# EAGLE board dachshund104 (EAGLE 9.7.0), part 1 of 3
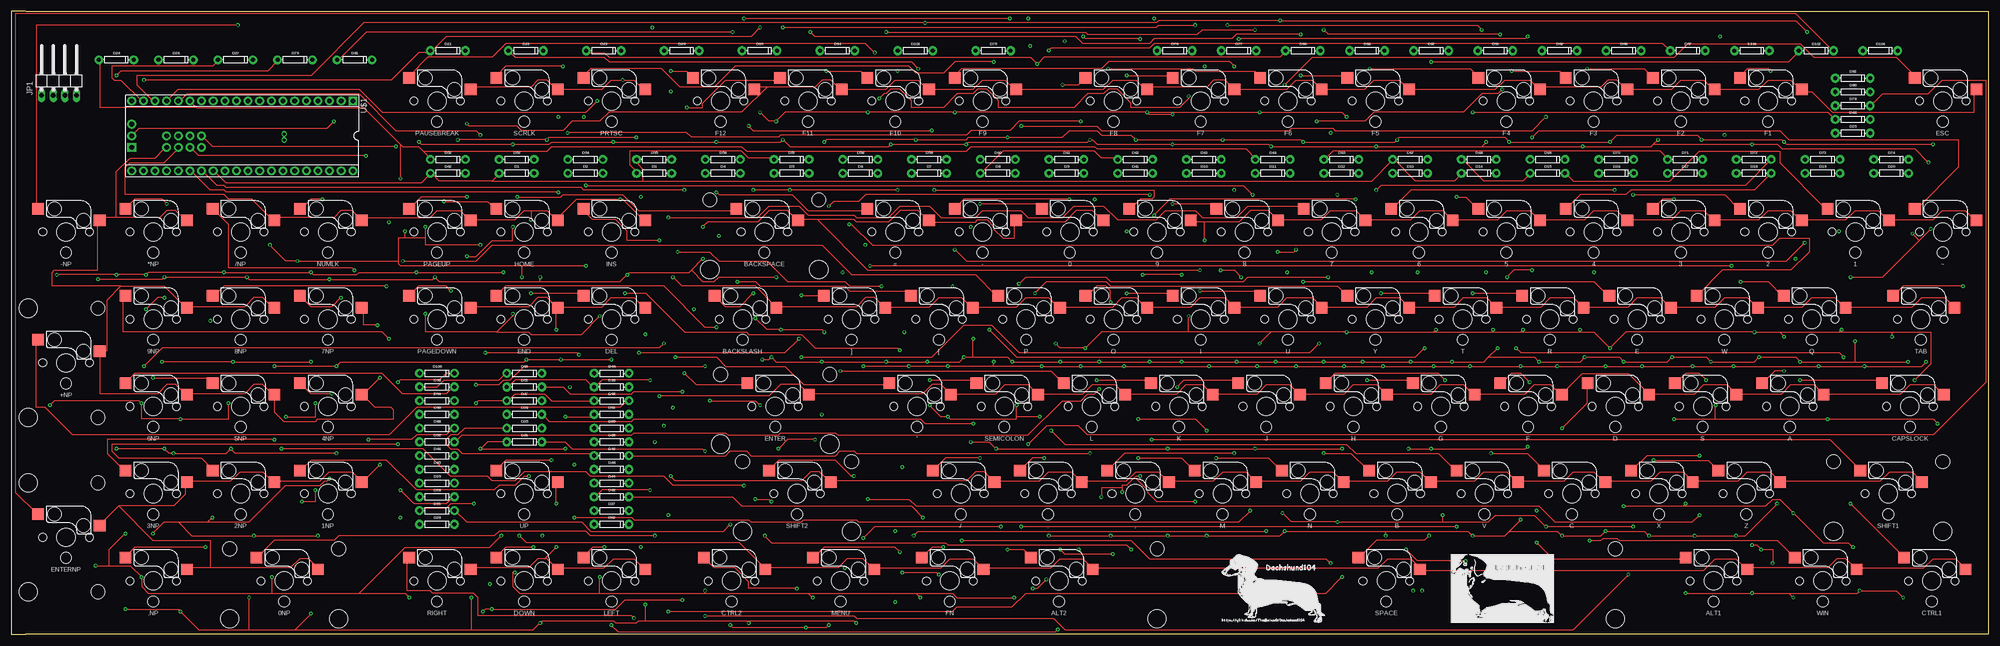
[diagram p5: board, top side]
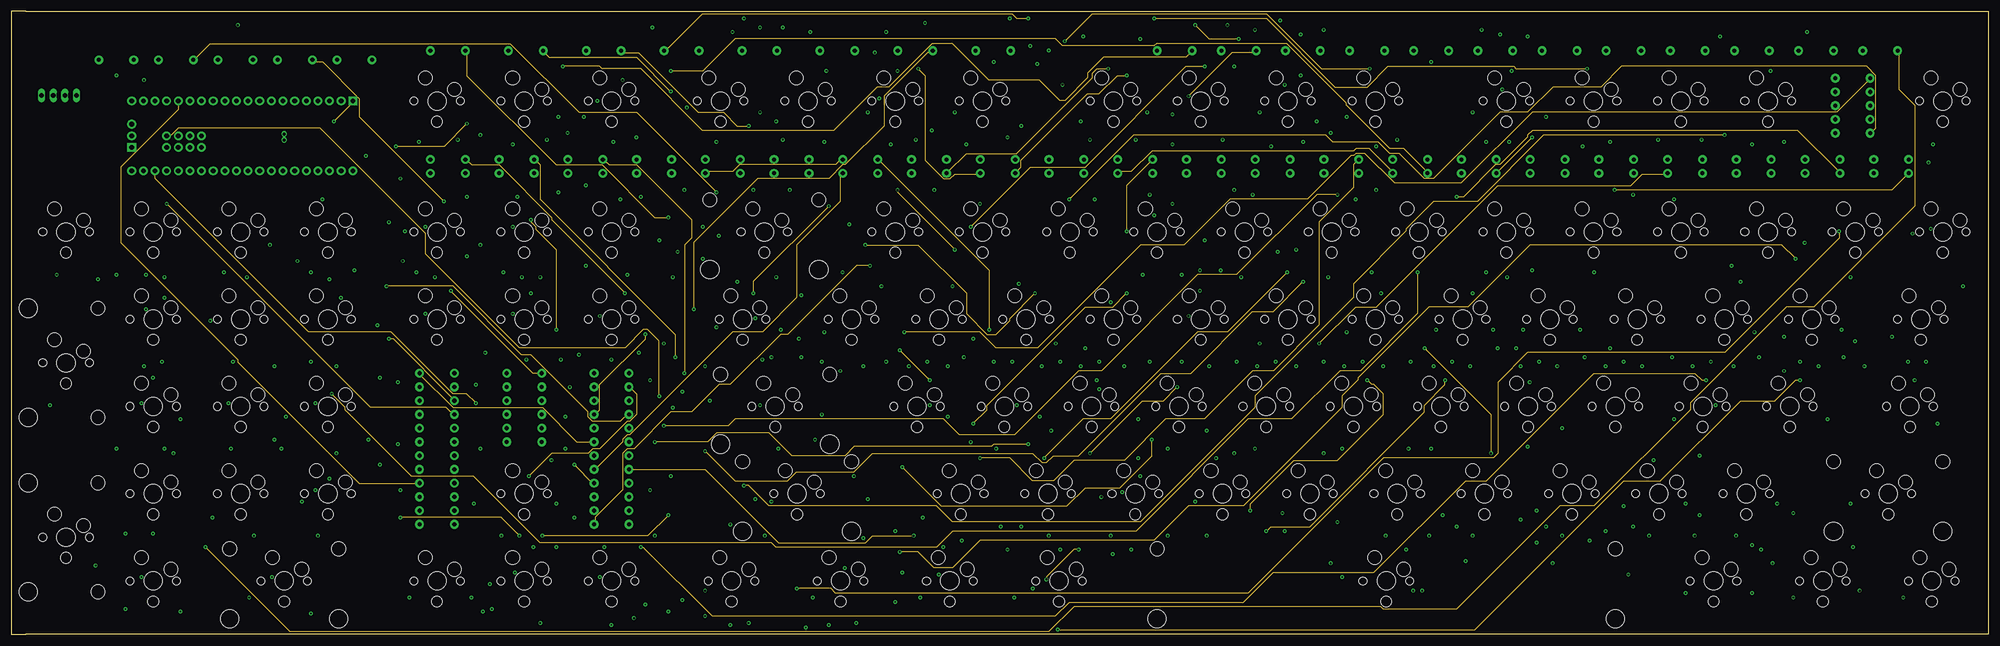
[diagram p6: board, inner layer Route2]
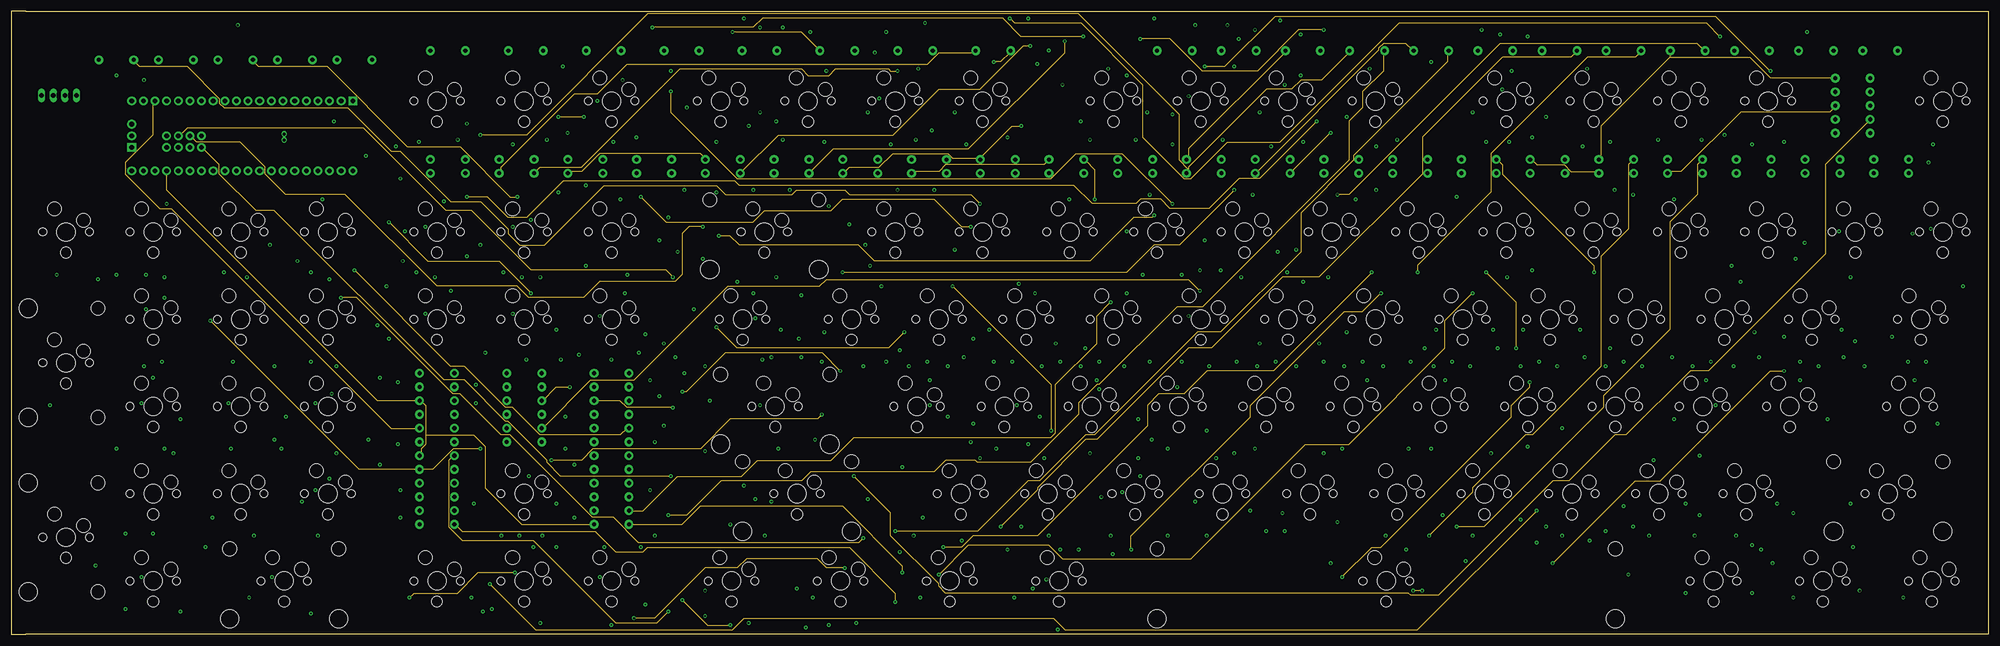
[diagram p7: board, inner layer Route15]
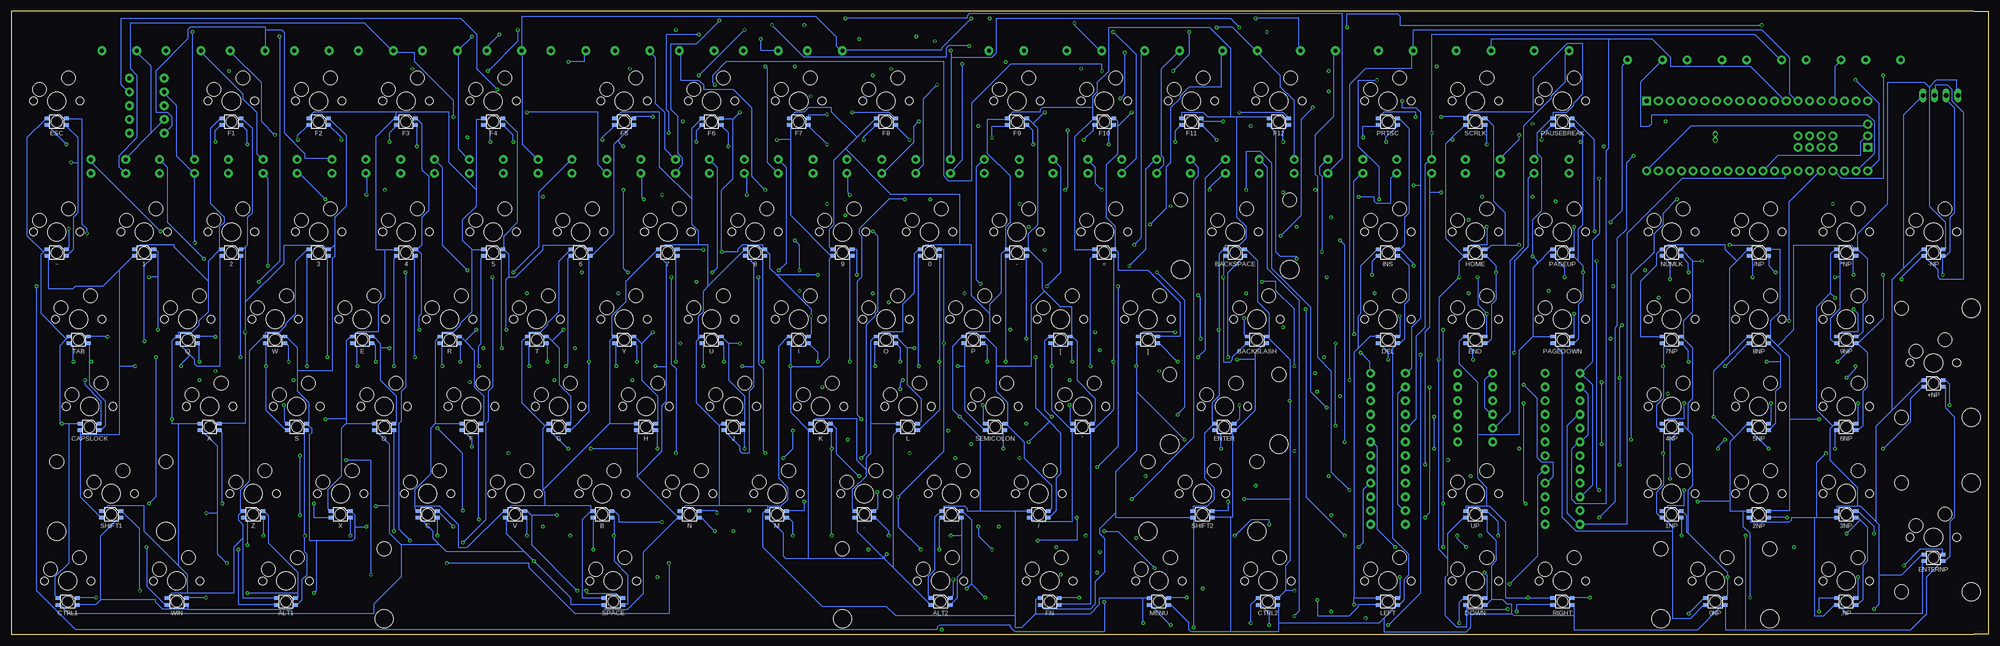
[diagram p8: board, bottom side, seen from below]

Size 431.38 x 136 mm. Coordinates in mm from the lower left corner, seen from the top.
Outline: 431.38,127 431.38,63.75 431.38,0 348.38,0 3.13,0 0.38,0 0,0 0,136 1.19,136 3.13,136 12.88,136 431.38,136 431.38,130.9 431.38,127
Copper layers (1+2*15+16): Top 0.035mm / dielectric 1.5mm / Route2 0.035mm / dielectric 0.15mm / Route15 0.035mm / dielectric 0.2mm / Bottom 0.035mm
Design rules "default *": minimum track width 0.2mm, minimum drill 0.35mm, track to track 0.5mm, track to pad 0.3mm, pad to pad 0.3mm, via to via 3mm, smd to smd 6mil, copper to edge 0.3mm, drill to drill 0.4mm, minimum pad ring 10mil, minimum via ring 8mil, stop-mask expansion 4mil, vias tented up to drill 0mil, thermal gap 10mil

## Footprints (pad centres in the part's own frame; a part is rotated, then mirrored left to right if it is on the bottom)
MXHSPCB-1U-SMDRGB = smd 1 x 0.75 bottom: B- 2.1,-5.225; G- -2.1,-5.225; LED+ 2.1,-3.775; R- -2.1,-3.775 | smd 2.55 x 2.5: MX1 7.36,2.54; MX2 -6.09,5.08 | hole 4: 0,0 | hole 1.7: 5.08,0; -5.08,0 | hole 3: 3.81,2.54; -2.54,5.08 | hole 2.4: 0,-4.5
MXHSPCB-2U-SMDRGB = smd 1 x 0.75 bottom: B- 2.1,-5.225; G- -2.1,-5.225; LED+ 2.1,-3.775; R- -2.1,-3.775 | smd 2.55 x 2.5: MX1 7.36,2.54; MX2 -6.09,5.08 | hole 4: 0,0; -11.9,-8.24; 11.9,-8.24 | hole 1.7: 5.08,0; -5.08,0 | hole 3: 3.81,2.54; -2.54,5.08 | hole 2.4: 0,-4.5 | hole 3.05: -11.9,7; 11.9,7
MXHSPCB-2U-SMDRGB-ROTATED = smd 1 x 0.75 bottom: B- 2.1,-5.225; G- -2.1,-5.225; LED+ 2.1,-3.775; R- -2.1,-3.775 | smd 2.55 x 2.5: MX1 7.36,2.54; MX2 -6.09,5.08 | hole 4: 0,0; -8.24,-11.9; -8.24,11.9 | hole 1.7: 5.08,0; -5.08,0 | hole 3: 3.81,2.54; -2.54,5.08 | hole 2.4: 0,-4.5 | hole 3.05: 7,-11.9; 7,11.9
DIODE-1N4148 = drill 0.9 pad 1.88: A -3.81,0; C 3.81,0
1X04/90 = drill 1.016 long: 1 -3.81,-3.81; 2 -1.27,-3.81; 3 1.27,-3.81; 4 3.81,-3.81
MXHSPCB-6.25U-SMDRGB = smd 1 x 0.75 bottom: B- 2.1,-5.225; G- -2.1,-5.225; LED+ 2.1,-3.775; R- -2.1,-3.775 | smd 2.55 x 2.5: MX1 7.36,2.54; MX2 -6.09,5.08 | hole 4: 0,0; -50,-8.24; 50,-8.24 | hole 1.7: 5.08,0; -5.08,0 | hole 3: 3.81,2.54; -2.54,5.08 | hole 2.4: 0,-4.5 | hole 3.05: -50,7; 50,7
TEENSY++ = drill 1.016 pad 1.88: 5V 24.13,-2.54; +5V -24.13,7.62; A0 8.89,0; A1 11.43,0; A2 13.97,0; A3 16.51,0; A4 8.89,2.54; A5 11.43,2.54; A6 13.97,2.54; A7 16.51,2.54; B0 -6.35,7.62; B1 -8.89,7.62; B2 -11.43,7.62; B3 -13.97,7.62; B4 -16.51,7.62; B5 -19.05,7.62; B6 -21.59,7.62; B7 -21.59,-7.62; C0 6.35,-7.62; C1 8.89,-7.62; C2 11.43,-7.62; C3 13.97,-7.62; C4 16.51,-7.62; C5 19.05,-7.62; C6 21.59,-7.62; C7 24.13,-7.62; D0 -19.05,-7.62; D1 -16.51,-7.62; D2 -13.97,-7.62; D3 -11.43,-7.62; D4 -8.89,-7.62; D5 -6.35,-7.62; D6 -3.81,-7.62; D7 -1.27,-7.62; E0 1.27,-7.62; E1 3.81,-7.62; E6 -1.27,7.62; E7 -3.81,7.62; F0 6.35,7.62; F1 8.89,7.62; F2 11.43,7.62; F3 13.97,7.62; F4 16.51,7.62; F5 19.05,7.62; F6 21.59,7.62; F7 24.13,7.62; GND2 24.13,0; GRND1 1.27,7.62; REF 3.81,7.62 | drill 0.635 pad 1.067: E4 -9.144,0.914; E5 -9.144,-0.406 | drill 1.016 pad 1.88 square: GND -24.13,-7.62; RST 24.13,2.54

## Placement (x,y rotation side)
0  KEYSWITCH-RGBSMDLED-MXHSPCB-1U-SMDRGB  [MXHSPCB-1U-SMDRGB]  230.98,87.85 0 top
0NP  KEYSWITCH-RGBSMDLED-MXHSPCB-2U-SMDRGB  [MXHSPCB-2U-SMDRGB]  59.53,11.65 0 top
1  KEYSWITCH-RGBSMDLED-MXHSPCB-1U-SMDRGB  [MXHSPCB-1U-SMDRGB]  402.43,87.85 0 top
1NP  KEYSWITCH-RGBSMDLED-MXHSPCB-1U-SMDRGB  [MXHSPCB-1U-SMDRGB]  69.06,30.7 0 top
2  KEYSWITCH-RGBSMDLED-MXHSPCB-1U-SMDRGB  [MXHSPCB-1U-SMDRGB]  383.38,87.85 0 top
2NP  KEYSWITCH-RGBSMDLED-MXHSPCB-1U-SMDRGB  [MXHSPCB-1U-SMDRGB]  50.01,30.7 0 top
3  KEYSWITCH-RGBSMDLED-MXHSPCB-1U-SMDRGB  [MXHSPCB-1U-SMDRGB]  364.33,87.85 0 top
3NP  KEYSWITCH-RGBSMDLED-MXHSPCB-1U-SMDRGB  [MXHSPCB-1U-SMDRGB]  30.96,30.7 0 top
4  KEYSWITCH-RGBSMDLED-MXHSPCB-1U-SMDRGB  [MXHSPCB-1U-SMDRGB]  345.28,87.85 0 top
4NP  KEYSWITCH-RGBSMDLED-MXHSPCB-1U-SMDRGB  [MXHSPCB-1U-SMDRGB]  69.06,49.75 0 top
5  KEYSWITCH-RGBSMDLED-MXHSPCB-1U-SMDRGB  [MXHSPCB-1U-SMDRGB]  326.23,87.85 0 top
5NP  KEYSWITCH-RGBSMDLED-MXHSPCB-1U-SMDRGB  [MXHSPCB-1U-SMDRGB]  50.01,49.75 0 top
6  KEYSWITCH-RGBSMDLED-MXHSPCB-1U-SMDRGB  [MXHSPCB-1U-SMDRGB]  307.18,87.85 0 top
6NP  KEYSWITCH-RGBSMDLED-MXHSPCB-1U-SMDRGB  [MXHSPCB-1U-SMDRGB]  30.96,49.75 0 top
7  KEYSWITCH-RGBSMDLED-MXHSPCB-1U-SMDRGB  [MXHSPCB-1U-SMDRGB]  288.13,87.85 0 top
7NP  KEYSWITCH-RGBSMDLED-MXHSPCB-1U-SMDRGB  [MXHSPCB-1U-SMDRGB]  69.06,68.8 0 top
8  KEYSWITCH-RGBSMDLED-MXHSPCB-1U-SMDRGB  [MXHSPCB-1U-SMDRGB]  269.08,87.85 0 top
8NP  KEYSWITCH-RGBSMDLED-MXHSPCB-1U-SMDRGB  [MXHSPCB-1U-SMDRGB]  50.01,68.8 0 top
9  KEYSWITCH-RGBSMDLED-MXHSPCB-1U-SMDRGB  [MXHSPCB-1U-SMDRGB]  250.03,87.85 0 top
9NP  KEYSWITCH-RGBSMDLED-MXHSPCB-1U-SMDRGB  [MXHSPCB-1U-SMDRGB]  30.96,68.8 0 top
'  KEYSWITCH-RGBSMDLED-MXHSPCB-1U-SMDRGB  [MXHSPCB-1U-SMDRGB]  197.64,49.75 0 top
*NP  KEYSWITCH-RGBSMDLED-MXHSPCB-1U-SMDRGB  [MXHSPCB-1U-SMDRGB]  30.96,87.85 0 top
+NP  KEYSWITCH-RGBSMDLED-MXHSPCB-2U-SMDRGB-ROTATED  [MXHSPCB-2U-SMDRGB-ROTATED]  11.91,59.28 0 top
,  KEYSWITCH-RGBSMDLED-MXHSPCB-1U-SMDRGB  [MXHSPCB-1U-SMDRGB]  245.27,30.7 0 top
,NP  KEYSWITCH-RGBSMDLED-MXHSPCB-1U-SMDRGB  [MXHSPCB-1U-SMDRGB]  30.96,11.65 0 top
-  KEYSWITCH-RGBSMDLED-MXHSPCB-1U-SMDRGB  [MXHSPCB-1U-SMDRGB]  211.93,87.85 0 top
-NP  KEYSWITCH-RGBSMDLED-MXHSPCB-1U-SMDRGB  [MXHSPCB-1U-SMDRGB]  11.91,87.85 0 top
.  KEYSWITCH-RGBSMDLED-MXHSPCB-1U-SMDRGB  [MXHSPCB-1U-SMDRGB]  226.22,30.7 0 top
/  KEYSWITCH-RGBSMDLED-MXHSPCB-1U-SMDRGB  [MXHSPCB-1U-SMDRGB]  207.17,30.7 0 top
/NP  KEYSWITCH-RGBSMDLED-MXHSPCB-1U-SMDRGB  [MXHSPCB-1U-SMDRGB]  50.01,87.85 0 top
=  KEYSWITCH-RGBSMDLED-MXHSPCB-1U-SMDRGB  [MXHSPCB-1U-SMDRGB]  192.88,87.85 0 top
[  KEYSWITCH-RGBSMDLED-MXHSPCB-1U-SMDRGB  [MXHSPCB-1U-SMDRGB]  202.41,68.8 0 top
]  KEYSWITCH-RGBSMDLED-MXHSPCB-1U-SMDRGB  [MXHSPCB-1U-SMDRGB]  183.36,68.8 0 top
A  KEYSWITCH-RGBSMDLED-MXHSPCB-1U-SMDRGB  [MXHSPCB-1U-SMDRGB]  388.14,49.75 0 top
ALT1  KEYSWITCH-RGBSMDLED-MXHSPCB-1U-SMDRGB  [MXHSPCB-1U-SMDRGB]  371.48,11.65 0 top
ALT2  KEYSWITCH-RGBSMDLED-MXHSPCB-1U-SMDRGB  [MXHSPCB-1U-SMDRGB]  228.6,11.65 0 top
B  KEYSWITCH-RGBSMDLED-MXHSPCB-1U-SMDRGB  [MXHSPCB-1U-SMDRGB]  302.42,30.7 0 top
BACKSLASH  KEYSWITCH-RGBSMDLED-MXHSPCB-1U-SMDRGB  [MXHSPCB-1U-SMDRGB]  159.54,68.8 0 top
BACKSPACE  KEYSWITCH-RGBSMDLED-MXHSPCB-2U-SMDRGB  [MXHSPCB-2U-SMDRGB]  164.31,87.85 0 top
C  KEYSWITCH-RGBSMDLED-MXHSPCB-1U-SMDRGB  [MXHSPCB-1U-SMDRGB]  340.52,30.7 0 top
CAPSLOCK  KEYSWITCH-RGBSMDLED-MXHSPCB-1U-SMDRGB  [MXHSPCB-1U-SMDRGB]  414.34,49.75 0 top
CTRL1  KEYSWITCH-RGBSMDLED-MXHSPCB-1U-SMDRGB  [MXHSPCB-1U-SMDRGB]  419.1,11.65 0 top
CTRL2  KEYSWITCH-RGBSMDLED-MXHSPCB-1U-SMDRGB  [MXHSPCB-1U-SMDRGB]  157.16,11.65 0 top
D  KEYSWITCH-RGBSMDLED-MXHSPCB-1U-SMDRGB  [MXHSPCB-1U-SMDRGB]  350.04,49.75 0 top
D1  200mA/100V/1V  [DIODE-1N4148]  110.25,100.66 0 top
D2  200mA/100V/1V  [DIODE-1N4148]  125.25,100.66 0 top
D3  200mA/100V/1V  [DIODE-1N4148]  140.25,100.66 0 top
D4  200mA/100V/1V  [DIODE-1N4148]  155.25,100.66 0 top
D5  200mA/100V/1V  [DIODE-1N4148]  170.25,100.66 0 top
D6  200mA/100V/1V  [DIODE-1N4148]  185.25,100.66 0 top
D7  200mA/100V/1V  [DIODE-1N4148]  200.25,100.66 0 top
D8  200mA/100V/1V  [DIODE-1N4148]  215.25,100.66 0 top
D9  200mA/100V/1V  [DIODE-1N4148]  230.25,100.66 0 top
D10  200mA/100V/1V  [DIODE-1N4148]  260.25,100.66 0 top
D11  200mA/100V/1V  [DIODE-1N4148]  275.25,100.66 0 top
D12  200mA/100V/1V  [DIODE-1N4148]  290.25,100.66 0 top
D13  200mA/100V/1V  [DIODE-1N4148]  305.25,100.66 0 top
D14  200mA/100V/1V  [DIODE-1N4148]  320.25,100.66 0 top
D15  200mA/100V/1V  [DIODE-1N4148]  335.25,100.66 0 top
D16  200mA/100V/1V  [DIODE-1N4148]  350.25,100.66 0 top
D17  200mA/100V/1V  [DIODE-1N4148]  365.25,100.66 0 top
D18  200mA/100V/1V  [DIODE-1N4148]  380.25,100.66 0 top
D19  200mA/100V/1V  [DIODE-1N4148]  395.25,100.66 0 top
D20  200mA/100V/1V  [DIODE-1N4148]  410.25,100.66 0 top
D21  200mA/100V/1V  [DIODE-1N4148]  95.25,127.42 0 top
D22  200mA/100V/1V  [DIODE-1N4148]  112.25,127.42 0 top
D23  200mA/100V/1V  [DIODE-1N4148]  129.25,127.42 0 top
D24  200mA/100V/1V  [DIODE-1N4148]  22.88,125.42 0 top
D25  200mA/100V/1V  [DIODE-1N4148]  401.86,109.42 0 top
D26  200mA/100V/1V  [DIODE-1N4148]  35.88,125.42 0 top
D27  200mA/100V/1V  [DIODE-1N4148]  48.88,125.42 0 top
D28  200mA/100V/1V  [DIODE-1N4148]  92.87,24 0 top
D29  200mA/100V/1V  [DIODE-1N4148]  146.25,127.42 0 top
D30  200mA/100V/1V  [DIODE-1N4148]  163.25,127.42 0 top
D31  200mA/100V/1V  [DIODE-1N4148]  111.92,42 0 top
D32  200mA/100V/1V  [DIODE-1N4148]  130.97,24 0 top
D33  200mA/100V/1V  [DIODE-1N4148]  92.87,27 0 top
D34  200mA/100V/1V  [DIODE-1N4148]  180.25,127.42 0 top
D35  200mA/100V/1V  [DIODE-1N4148]  111.92,45 0 top
D36  200mA/100V/1V  [DIODE-1N4148]  111.92,48 0 top
D37  200mA/100V/1V  [DIODE-1N4148]  130.97,27 0 top
D38  200mA/100V/1V  [DIODE-1N4148]  92.87,30 0 top
D39  200mA/100V/1V  [DIODE-1N4148]  92.87,33 0 top
D40  200mA/100V/1V  [DIODE-1N4148]  130.97,57 0 top
D41  200mA/100V/1V  [DIODE-1N4148]  245.25,100.66 0 top
D42  200mA/100V/1V  [DIODE-1N4148]  95.25,100.66 0 top
D43  200mA/100V/1V  [DIODE-1N4148]  130.97,30 0 top
D44  200mA/100V/1V  [DIODE-1N4148]  130.97,33 0 top
D45  200mA/100V/1V  [DIODE-1N4148]  92.87,36 0 top
D46  200mA/100V/1V  [DIODE-1N4148]  92.87,39 0 top
D47  200mA/100V/1V  [DIODE-1N4148]  111.92,51 0 top
D48  200mA/100V/1V  [DIODE-1N4148]  130.97,36 0 top
D49  200mA/100V/1V  [DIODE-1N4148]  130.97,39 0 top
D50  200mA/100V/1V  [DIODE-1N4148]  92.87,42 0 top
D51  200mA/100V/1V  [DIODE-1N4148]  111.92,54 0 top
D52  200mA/100V/1V  [DIODE-1N4148]  95.25,103.66 0 top
D53  200mA/100V/1V  [DIODE-1N4148]  110.25,103.66 0 top
D54  200mA/100V/1V  [DIODE-1N4148]  125.25,103.66 0 top
D55  200mA/100V/1V  [DIODE-1N4148]  140.25,103.66 0 top
D56  200mA/100V/1V  [DIODE-1N4148]  155.25,103.66 0 top
D57  200mA/100V/1V  [DIODE-1N4148]  170.25,103.66 0 top
D58  200mA/100V/1V  [DIODE-1N4148]  185.25,103.66 0 top
D59  200mA/100V/1V  [DIODE-1N4148]  200.25,103.66 0 top
D60  200mA/100V/1V  [DIODE-1N4148]  215.25,103.66 0 top
D61  200mA/100V/1V  [DIODE-1N4148]  230.25,103.66 0 top
D62  200mA/100V/1V  [DIODE-1N4148]  245.25,103.66 0 top
D63  200mA/100V/1V  [DIODE-1N4148]  260.25,103.66 0 top
D64  200mA/100V/1V  [DIODE-1N4148]  275.25,103.66 0 top
D65  200mA/100V/1V  [DIODE-1N4148]  290.25,103.66 0 top
D66  200mA/100V/1V  [DIODE-1N4148]  401.86,112.42 0 top
D67  200mA/100V/1V  [DIODE-1N4148]  305.25,103.66 0 top
D68  200mA/100V/1V  [DIODE-1N4148]  320.25,103.66 0 top
D69  200mA/100V/1V  [DIODE-1N4148]  335.25,103.66 0 top
D70  200mA/100V/1V  [DIODE-1N4148]  350.25,103.66 0 top
D71  200mA/100V/1V  [DIODE-1N4148]  365.25,103.66 0 top
D72  200mA/100V/1V  [DIODE-1N4148]  380.25,103.66 0 top
D73  200mA/100V/1V  [DIODE-1N4148]  395.25,103.66 0 top
D74  200mA/100V/1V  [DIODE-1N4148]  410.25,103.66 0 top
D75  200mA/100V/1V  [DIODE-1N4148]  214.25,127.42 0 top
D76  200mA/100V/1V  [DIODE-1N4148]  253.84,127.42 0 top
D77  200mA/100V/1V  [DIODE-1N4148]  267.84,127.42 0 top
D78  200mA/100V/1V  [DIODE-1N4148]  401.86,115.42 0 top
D79  200mA/100V/1V  [DIODE-1N4148]  61.88,125.42 0 top
D80  200mA/100V/1V  [DIODE-1N4148]  401.86,118.42 0 top
D81  200mA/100V/1V  [DIODE-1N4148]  74.88,125.42 0 top
D82  200mA/100V/1V  [DIODE-1N4148]  401.86,121.42 0 top
D83  200mA/100V/1V  [DIODE-1N4148]  111.92,57 0 top
D84  200mA/100V/1V  [DIODE-1N4148]  281.84,127.42 0 top
D85  200mA/100V/1V  [DIODE-1N4148]  130.97,42 0 top
D86  200mA/100V/1V  [DIODE-1N4148]  295.84,127.42 0 top
D87  200mA/100V/1V  [DIODE-1N4148]  309.84,127.42 0 top
D88  200mA/100V/1V  [DIODE-1N4148]  92.87,45 0 top
D89  200mA/100V/1V  [DIODE-1N4148]  130.97,45 0 top
D90  200mA/100V/1V  [DIODE-1N4148]  92.87,48 0 top
D91  200mA/100V/1V  [DIODE-1N4148]  323.84,127.42 0 top
D92  200mA/100V/1V  [DIODE-1N4148]  337.84,127.42 0 top
D93  200mA/100V/1V  [DIODE-1N4148]  130.97,48 0 top
D94  200mA/100V/1V  [DIODE-1N4148]  92.87,51 0 top
D95  200mA/100V/1V  [DIODE-1N4148]  130.97,51 0 top
D96  200mA/100V/1V  [DIODE-1N4148]  351.84,127.42 0 top
D97  200mA/100V/1V  [DIODE-1N4148]  365.84,127.42 0 top
D98  200mA/100V/1V  [DIODE-1N4148]  92.87,54 0 top
D99  200mA/100V/1V  [DIODE-1N4148]  130.97,54 0 top
D100  200mA/100V/1V  [DIODE-1N4148]  92.87,57 0 top
D101  200mA/100V/1V  [DIODE-1N4148]  379.84,127.42 0 top
D102  200mA/100V/1V  [DIODE-1N4148]  393.84,127.42 0 top
D103  200mA/100V/1V  [DIODE-1N4148]  197.25,127.42 0 top
D104  200mA/100V/1V  [DIODE-1N4148]  407.84,127.42 0 top
DEL  KEYSWITCH-RGBSMDLED-MXHSPCB-1U-SMDRGB  [MXHSPCB-1U-SMDRGB]  130.97,68.8 0 top
DOWN  KEYSWITCH-RGBSMDLED-MXHSPCB-1U-SMDRGB  [MXHSPCB-1U-SMDRGB]  111.92,11.65 0 top
E  KEYSWITCH-RGBSMDLED-MXHSPCB-1U-SMDRGB  [MXHSPCB-1U-SMDRGB]  354.81,68.8 0 top
END  KEYSWITCH-RGBSMDLED-MXHSPCB-1U-SMDRGB  [MXHSPCB-1U-SMDRGB]  111.92,68.8 0 top
ENTER  KEYSWITCH-RGBSMDLED-MXHSPCB-2U-SMDRGB  [MXHSPCB-2U-SMDRGB]  166.69,49.75 0 top
ENTERNP  KEYSWITCH-RGBSMDLED-MXHSPCB-2U-SMDRGB-ROTATED  [MXHSPCB-2U-SMDRGB-ROTATED]  11.91,21.17 0 top
ESC  KEYSWITCH-RGBSMDLED-MXHSPCB-1U-SMDRGB  [MXHSPCB-1U-SMDRGB]  421.48,116.42 0 top
F  KEYSWITCH-RGBSMDLED-MXHSPCB-1U-SMDRGB  [MXHSPCB-1U-SMDRGB]  330.99,49.75 0 top
F1  KEYSWITCH-RGBSMDLED-MXHSPCB-1U-SMDRGB  [MXHSPCB-1U-SMDRGB]  383.38,116.42 0 top
F2  KEYSWITCH-RGBSMDLED-MXHSPCB-1U-SMDRGB  [MXHSPCB-1U-SMDRGB]  364.33,116.42 0 top
F3  KEYSWITCH-RGBSMDLED-MXHSPCB-1U-SMDRGB  [MXHSPCB-1U-SMDRGB]  345.28,116.42 0 top
F4  KEYSWITCH-RGBSMDLED-MXHSPCB-1U-SMDRGB  [MXHSPCB-1U-SMDRGB]  326.23,116.42 0 top
F5  KEYSWITCH-RGBSMDLED-MXHSPCB-1U-SMDRGB  [MXHSPCB-1U-SMDRGB]  297.66,116.42 0 top
F6  KEYSWITCH-RGBSMDLED-MXHSPCB-1U-SMDRGB  [MXHSPCB-1U-SMDRGB]  278.61,116.42 0 top
F7  KEYSWITCH-RGBSMDLED-MXHSPCB-1U-SMDRGB  [MXHSPCB-1U-SMDRGB]  259.56,116.42 0 top
F8  KEYSWITCH-RGBSMDLED-MXHSPCB-1U-SMDRGB  [MXHSPCB-1U-SMDRGB]  240.51,116.42 0 top
F9  KEYSWITCH-RGBSMDLED-MXHSPCB-1U-SMDRGB  [MXHSPCB-1U-SMDRGB]  211.93,116.42 0 top
F10  KEYSWITCH-RGBSMDLED-MXHSPCB-1U-SMDRGB  [MXHSPCB-1U-SMDRGB]  192.88,116.42 0 top
F11  KEYSWITCH-RGBSMDLED-MXHSPCB-1U-SMDRGB  [MXHSPCB-1U-SMDRGB]  173.83,116.42 0 top
F12  KEYSWITCH-RGBSMDLED-MXHSPCB-1U-SMDRGB  [MXHSPCB-1U-SMDRGB]  154.78,116.42 0 top
FN  KEYSWITCH-RGBSMDLED-MXHSPCB-1U-SMDRGB  [MXHSPCB-1U-SMDRGB]  204.79,11.65 0 top
G  KEYSWITCH-RGBSMDLED-MXHSPCB-1U-SMDRGB  [MXHSPCB-1U-SMDRGB]  311.94,49.75 0 top
H  KEYSWITCH-RGBSMDLED-MXHSPCB-1U-SMDRGB  [MXHSPCB-1U-SMDRGB]  292.89,49.75 0 top
HOME  KEYSWITCH-RGBSMDLED-MXHSPCB-1U-SMDRGB  [MXHSPCB-1U-SMDRGB]  111.92,87.85 0 top
I  KEYSWITCH-RGBSMDLED-MXHSPCB-1U-SMDRGB  [MXHSPCB-1U-SMDRGB]  259.56,68.8 0 top
INS  KEYSWITCH-RGBSMDLED-MXHSPCB-1U-SMDRGB  [MXHSPCB-1U-SMDRGB]  130.97,87.85 0 top
J  KEYSWITCH-RGBSMDLED-MXHSPCB-1U-SMDRGB  [MXHSPCB-1U-SMDRGB]  273.84,49.75 0 top
JP1  PINHD-1X4/90  [1X04/90]  10.4,121.5 0 top
K  KEYSWITCH-RGBSMDLED-MXHSPCB-1U-SMDRGB  [MXHSPCB-1U-SMDRGB]  254.79,49.75 0 top
L  KEYSWITCH-RGBSMDLED-MXHSPCB-1U-SMDRGB  [MXHSPCB-1U-SMDRGB]  235.74,49.75 0 top
LEFT  KEYSWITCH-RGBSMDLED-MXHSPCB-1U-SMDRGB  [MXHSPCB-1U-SMDRGB]  130.97,11.65 0 top
M  KEYSWITCH-RGBSMDLED-MXHSPCB-1U-SMDRGB  [MXHSPCB-1U-SMDRGB]  264.32,30.7 0 top
MENU  KEYSWITCH-RGBSMDLED-MXHSPCB-1U-SMDRGB  [MXHSPCB-1U-SMDRGB]  180.97,11.65 0 top
N  KEYSWITCH-RGBSMDLED-MXHSPCB-1U-SMDRGB  [MXHSPCB-1U-SMDRGB]  283.37,30.7 0 top
NUMLK  KEYSWITCH-RGBSMDLED-MXHSPCB-1U-SMDRGB  [MXHSPCB-1U-SMDRGB]  69.06,87.85 0 top
O  KEYSWITCH-RGBSMDLED-MXHSPCB-1U-SMDRGB  [MXHSPCB-1U-SMDRGB]  240.51,68.8 0 top
P  KEYSWITCH-RGBSMDLED-MXHSPCB-1U-SMDRGB  [MXHSPCB-1U-SMDRGB]  221.46,68.8 0 top
PAGEDOWN  KEYSWITCH-RGBSMDLED-MXHSPCB-1U-SMDRGB  [MXHSPCB-1U-SMDRGB]  92.87,68.8 0 top
PAGEUP  KEYSWITCH-RGBSMDLED-MXHSPCB-1U-SMDRGB  [MXHSPCB-1U-SMDRGB]  92.87,87.85 0 top
PAUSEBREAK  KEYSWITCH-RGBSMDLED-MXHSPCB-1U-SMDRGB  [MXHSPCB-1U-SMDRGB]  92.87,116.42 0 top
PRTSC  KEYSWITCH-RGBSMDLED-MXHSPCB-1U-SMDRGB  [MXHSPCB-1U-SMDRGB]  130.97,116.42 0 top
Q  KEYSWITCH-RGBSMDLED-MXHSPCB-1U-SMDRGB  [MXHSPCB-1U-SMDRGB]  392.91,68.8 0 top
R  KEYSWITCH-RGBSMDLED-MXHSPCB-1U-SMDRGB  [MXHSPCB-1U-SMDRGB]  335.76,68.8 0 top
RIGHT  KEYSWITCH-RGBSMDLED-MXHSPCB-1U-SMDRGB  [MXHSPCB-1U-SMDRGB]  92.87,11.65 0 top
S  KEYSWITCH-RGBSMDLED-MXHSPCB-1U-SMDRGB  [MXHSPCB-1U-SMDRGB]  369.09,49.75 0 top
SCRLK  KEYSWITCH-RGBSMDLED-MXHSPCB-1U-SMDRGB  [MXHSPCB-1U-SMDRGB]  111.92,116.42 0 top
SEMICOLON  KEYSWITCH-RGBSMDLED-MXHSPCB-1U-SMDRGB  [MXHSPCB-1U-SMDRGB]  216.69,49.75 0 top
SHIFT1  KEYSWITCH-RGBSMDLED-MXHSPCB-2U-SMDRGB  [MXHSPCB-2U-SMDRGB]  409.57,30.7 0 top
SHIFT2  KEYSWITCH-RGBSMDLED-MXHSPCB-2U-SMDRGB  [MXHSPCB-2U-SMDRGB]  171.45,30.7 0 top
SPACE  KEYSWITCH-RGBSMDLED-MXHSPCB-6.25U-SMDRGB  [MXHSPCB-6.25U-SMDRGB]  300.04,11.65 0 top
T  KEYSWITCH-RGBSMDLED-MXHSPCB-1U-SMDRGB  [MXHSPCB-1U-SMDRGB]  316.71,68.8 0 top
TAB  KEYSWITCH-RGBSMDLED-MXHSPCB-1U-SMDRGB  [MXHSPCB-1U-SMDRGB]  416.72,68.8 0 top
U  KEYSWITCH-RGBSMDLED-MXHSPCB-1U-SMDRGB  [MXHSPCB-1U-SMDRGB]  278.61,68.8 0 top
U$1  C-TEENSY++  [TEENSY++]  50.38,108.85 180 top
UP  KEYSWITCH-RGBSMDLED-MXHSPCB-1U-SMDRGB  [MXHSPCB-1U-SMDRGB]  111.92,30.7 0 top
V  KEYSWITCH-RGBSMDLED-MXHSPCB-1U-SMDRGB  [MXHSPCB-1U-SMDRGB]  321.47,30.7 0 top
W  KEYSWITCH-RGBSMDLED-MXHSPCB-1U-SMDRGB  [MXHSPCB-1U-SMDRGB]  373.86,68.8 0 top
WIN  KEYSWITCH-RGBSMDLED-MXHSPCB-1U-SMDRGB  [MXHSPCB-1U-SMDRGB]  395.29,11.65 0 top
X  KEYSWITCH-RGBSMDLED-MXHSPCB-1U-SMDRGB  [MXHSPCB-1U-SMDRGB]  359.57,30.7 0 top
Y  KEYSWITCH-RGBSMDLED-MXHSPCB-1U-SMDRGB  [MXHSPCB-1U-SMDRGB]  297.66,68.8 0 top
Z  KEYSWITCH-RGBSMDLED-MXHSPCB-1U-SMDRGB  [MXHSPCB-1U-SMDRGB]  378.62,30.7 0 top
~  KEYSWITCH-RGBSMDLED-MXHSPCB-1U-SMDRGB  [MXHSPCB-1U-SMDRGB]  421.48,87.85 0 top

## Tracks (layer width: path | path; a pad name or v marks a point on that pad's centre or on a via)
B  (via drill 0.35)
  Top 0.2: v22.88,40.5 v33.38,40.5 34.38,39.5 v35.38,39.5 46.88,39.5 v47.88,40.5 48.88,39.5 v70.88,39.5 | v57.38,58.5 v70.88,58.5 71.88,59.5 111.88,59.5 v112.38,60 v119.88,60 v130.88,60 | v97.38,108 v116.88,108 117.38,108.5 v136.38,108.5 | 115.38,77 93.38,77 v92.38,78 91.88,77.5 v69.38,77.5 51.88,77.5 v51.38,78 v33.38,78 32.88,77.5 v18.88,77.5 | 115.38,77 132.88,77 v134.38,78.5 134.88,79 147.88,79 148.38,79.5 | 148.38,79.5 v150.88,82 | v166.88,78 154.38,78 153.38,77 150.88,77 148.38,79.5 | 115.38,77 v115.38,78 | v177.38,107.5 177.88,108 v197.38,108 208.38,108 208.88,108.5 v217.38,108.5 229.38,108.5 230.88,110 236.88,110 237.88,109 244.38,109 v245.38,108 v264.38,108 281.38,108 v281.88,107.5 301.88,107.5 v302.38,108 302.88,108.5 325.88,108.5 v326.88,107.5 v348.88,107.5 350.38,109 367.88,109 v368.88,108 386.38,108 v386.88,107.5 387.38,107 v419.38,107 | v304.88,40.5 v309.88,40.5 330.38,40.5 v330.88,41 | v379.88,19.5 380.88,19.5 v381.88,18.5 384.38,18.5 v384.38,15.5 | v304.38,18.5 306.88,16 v317.38,16 | 364.88,28 v365.38,28.5 | v351.88,28 364.88,28 | v401.88,19 400.88,20 395.38,20 v388.88,26.5 385.88,29.5 384.38,29.5 382.88,28 364.88,28 | v228.88,18.5 229.88,17.5 v240.38,17.5 | v102.88,5 103.38,5.5 v104.88,5.5 131.88,5.5 133.88,7.5 v146.38,7.5 | v178.38,2 177.88,1.5 v173.38,1.5 157.38,1.5 v156.88,2 | v167.38,40.5 169.38,42.5 v175.38,42.5 | 214.38,58.5 v224.88,58.5 v233.38,58.5 v242.88,58.5 v261.38,58.5 v271.88,58.5 v280.38,58.5 v290.88,58.5 v299.38,58.5 v310.38,58.5 v318.38,58.5 v329.38,58.5 v337.38,58.5 v347.88,58.5 v355.88,58.5 v366.88,58.5 v375.88,58.5 v394.38,58.5 v404.38,58.5 416.88,58.5 v417.88,59.5
  Top 0.2: 214.38,58.5 v204.38,58.5 v195.88,58.5 v185.88,58.5 | 214.38,58.5 v214.38,59.5
  Route15 0.2: v156.88,2 151.88,2 v146.38,7.5
  Bottom 0.2: 68.88,22.5 68.88,23.5 70.88,25.5 1NP.B- 71.38,25.5 72.38,26.5 72.38,31 70.88,32.5 v70.88,39.5 70.88,44.5 4NP.B- 71.38,44.5 72.38,45.5 72.38,50 70.88,51.5 v70.88,58.5 70.88,63.5 7NP.B- | 68.88,22.5 68.88,3.5 64.88,3.5 61.88,6.5 0NP.B- | 68.88,22.5 89.88,22.5 92.88,25.5 92.88,61.5 94.88,63.5 PAGEDOWN.B- | ENTERNP.B- 14.38,16 14.38,4.5 30.88,4.5 32.88,6.5 ,NP.B- 33.38,6.5 35.88,4 37.88,4 37.88,25.5 | 37.88,25.5 42.88,25.5 42.88,25 43.38,24.5 51.88,24.5 51.88,25.5 2NP.B- | 37.88,25.5 37.38,25.5 | 37.38,25.5 33.38,25.5 3NP.B- | v33.38,40.5 33.38,44.5 6NP.B- | v35.38,39.5 37.38,37.5 37.38,25.5 | v47.88,40.5 51.88,44.5 5NP.B- | v22.88,40.5 16.88,46.5 16.88,51.5 14.38,54 +NP.B- | v57.38,58.5 52.38,63.5 8NP.B- | v112.38,60 112.38,62 113.88,63.5 END.B- | v130.88,60 130.88,61.5 132.88,63.5 DEL.B- | 114.38,82.5 118.38,86.5 118.38,107 116.88,108.5 | 116.88,108.5 114.38,111 SCRLK.B- | 114.38,82.5 HOME.B- 114.38,82.5 | v97.38,108 97.38,109 95.38,111 PAUSEBREAK.B- | 116.88,108.5 v116.88,108 | v136.38,108.5 136.38,111 133.38,111 PRTSC.B- | JP1.3 11.38,118 11.38,120 8.88,120 7.88,119 7.88,116.5 5.38,114 5.38,77.5 10.38,77.5 10.88,78 10.88,79.5 13.88,82.5 -NP.B- 14.38,82.5 18.88,78 v18.88,77.5 | BACKSLASH.B- 161.88,63.5 164.88,60.5 164.88,60 165.38,59.5 166.88,59.5 v166.88,78 166.88,82.5 BACKSPACE.B- | 32.38,78 32.38,82 32.88,82.5 *NP.B- | 32.38,78 32.38,71 34.38,69 34.38,64.5 33.38,63.5 9NP.B- | v51.38,78 51.38,82 51.88,82.5 /NP.B- | 32.38,78 v33.38,78 | v69.38,77.5 69.38,81 70.88,82.5 NUMLK.B- | v92.38,78 92.38,80 94.88,82.5 PAGEUP.B- | v134.38,78.5 134.38,81.5 133.38,82.5 INS.B-
  Bottom 0.2: v150.88,82 150.88,82.5 154.38,82.5 155.38,83.5 155.38,109.5 156.88,111 F12.B- | 114.38,82.5 115.38,81.5 v115.38,78 119.88,73.5 v119.88,60 119.88,18.5 117.88,16.5 | v177.38,107.5 177.38,110 176.38,111 F11.B- | v197.38,108 195.38,110 195.38,111 F10.B- | v217.38,108.5 217.38,111 214.38,111 F9.B- | v245.38,108 245.38,108.5 242.88,111 F8.B- | v281.88,107.5 281.88,110 280.88,111 F6.B- | v302.38,108 302.38,108.5 299.88,111 F5.B- | v326.88,107.5 326.88,110 327.88,111 F4.B- | v348.88,107.5 348.88,109.5 347.38,111 F3.B- | v368.88,108 368.88,109 366.88,111 F2.B- | v386.88,107.5 386.88,110 385.88,111 F1.B- | v419.38,107 423.38,111 ESC.B- | 294.88,34.5 285.88,25.5 | 294.88,40.5 294.88,44.5 H.B- | 294.88,40.5 294.88,34.5 | 285.88,25.5 N.B- 285.88,25.5 | 288.38,58.5 288.38,51 289.38,50 289.38,40 294.88,34.5 | 288.38,58.5 288.38,81 289.88,82.5 7.B- | v309.88,40.5 313.88,44.5 G.B- | 294.88,40.5 v304.88,40.5 | v330.88,41 330.88,42.5 332.88,44.5 F.B- | v381.88,18.5 381.88,6.5 373.88,6.5 ALT1.B- | v379.88,19.5 379.88,25 380.38,25.5 Z.B- | 386.38,26.5 386.38,17.5 v384.38,15.5 | 386.38,26.5 386.38,41 389.88,44.5 A.B- | 319.38,18 323.38,22 323.38,25.5 V.B- | 319.38,18 v317.38,16 309.38,8 309.38,6.5 302.38,6.5 SPACE.B- 301.88,6.5 301.88,5.5 296.88,5.5 293.38,9 293.38,18 285.88,25.5 | v304.38,18.5 304.38,25.5 B.B- | 337.88,19.5 336.38,18 319.38,18 | 337.88,19.5 339.38,21 339.38,22.5 342.38,25.5 C.B- | 348.88,28 348.88,22 346.38,19.5 | 348.88,28 348.88,41.5 351.88,44.5 D.B- | 337.88,19.5 346.38,19.5 | v365.38,28.5 365.38,25.5 361.88,25.5 X.B- | 348.88,28 v351.88,28 | v401.88,19 401.88,10.5 397.88,6.5 WIN.B- | 346.38,19.5 346.38,12.5 352.38,6.5 352.38,4.5 418.88,4.5 420.88,6.5 CTRL1.B-
  Bottom 0.2: v388.88,26.5 386.38,26.5 | 252.38,82.5 261.38,91.5 261.38,108 | 261.38,108 261.38,111 F7.B- | 252.38,82.5 9.B- 252.38,82.5 | 257.38,44.5 261.38,48.5 v261.38,58.5 | v261.38,58.5 261.38,63.5 I.B- | 257.38,44.5 K.B- 257.38,44.5 | 240.88,16.5 246.88,22.5 246.88,25.5 ,.B- | 240.88,16.5 238.88,14.5 | 238.88,14.5 230.88,6.5 ALT2.B- | v228.88,18.5 228.88,25 228.38,25.5 ..B- | v240.38,17.5 240.88,17 240.88,16.5 | 238.88,14.5 238.88,43.5 237.88,44.5 L.B- | 240.88,16.5 257.38,16.5 | 257.38,16.5 262.38,16.5 262.88,17 262.88,22 266.38,25.5 M.B- | 257.38,16.5 257.38,44.5 | 252.38,82.5 252.88,82 252.88,60.5 254.88,58.5 v261.38,58.5 | v102.88,5 102.88,6.5 95.38,6.5 RIGHT.B- | 113.88,5.5 v104.88,5.5 | 113.88,5.5 113.88,6.5 DOWN.B- | 117.88,16.5 117.88,13 118.38,12.5 118.38,4 115.88,1.5 113.88,1.5 113.88,5.5 | 117.88,16.5 117.88,22 114.38,25.5 UP.B- | v146.38,7.5 146.38,4 139.38,4 137.38,6 137.38,6.5 133.38,6.5 LEFT.B- | v156.88,2 156.88,4.5 158.88,6.5 CTRL2.B- | v178.38,2 182.88,6.5 MENU.B- | 190.38,26.5 190.38,35.5 185.88,40 185.88,53 | 190.38,26.5 190.38,25.5 173.88,25.5 SHIFT2.B- 173.38,25.5 v173.38,1.5 | 185.88,53 v185.88,58.5 185.88,63.5 ].B- | v167.38,40.5 167.38,43.5 168.38,44.5 ENTER.B- | 185.88,53 v175.38,42.5 | 190.38,26.5 193.88,23 193.88,22 192.88,21 192.88,13.5 194.88,11.5 194.88,6.5 195.88,5.5 205.88,5.5 206.88,6.5 FN.B- | 416.38,43.5 416.38,44.5 CAPSLOCK.B- | 416.38,43.5 416.38,30 411.88,25.5 SHIFT1.B- | 407.88,79.5 411.38,76 417.38,76 417.88,75.5 423.38,75.5 423.38,82.5 ~.B- | 407.88,79.5 404.88,82.5 1.B- | 416.38,43.5 407.88,43.5 407.88,58.5 | 407.88,79.5 407.88,58.5 | 269.38,58.5 269.38,81 270.88,82.5 8.B-
  Bottom 0.2: 269.38,58.5 269.38,54 270.38,53 270.38,39.5 271.88,39.5 272.38,40 272.38,41 275.88,44.5 J.B- | 199.88,44.5 204.38,49 v204.38,58.5 204.38,63.5 [.B- | 199.88,44.5 '.B- 199.88,44.5 | 199.88,44.5 199.88,24.5 207.88,24.5 208.88,25.5 /.B- | 392.38,61 391.38,60 391.38,59 390.88,58.5 385.88,58.5 385.88,82.5 2.B- | 392.38,61 394.88,63.5 Q.B- | S.B- 371.38,44.5 375.88,49 v375.88,58.5 375.88,63.5 W.B- | 223.38,58.5 223.38,63.5 P.B- | 223.38,58.5 223.38,49 218.88,44.5 SEMICOLON.B- | v242.88,58.5 242.88,63.5 O.B- | 223.38,58.5 v224.88,58.5 | v280.38,58.5 280.38,63.5 U.B- | v195.88,58.5 195.88,82 195.38,82.5 =.B- | v214.38,59.5 214.38,82.5 -.B- | v233.38,58.5 233.38,82.5 0.B- | v299.38,58.5 299.38,63.5 Y.B- | v318.38,58.5 318.38,63.5 T.B- | v310.38,58.5 309.88,59 309.88,82 309.38,82.5 6.B- | v337.38,58.5 337.38,63.5 R.B- | v329.38,58.5 329.38,63 328.88,63.5 328.88,82 328.38,82.5 5.B- | v355.88,58.5 355.88,62.5 356.88,63.5 E.B- | v347.88,58.5 347.88,82 347.38,82.5 4.B- | v366.88,58.5 366.88,82.5 3.B- | v417.88,59.5 417.88,63 418.38,63.5 TAB.B- | 392.38,61 394.38,59 v394.38,58.5 | v271.88,58.5 269.38,58.5 | v404.38,58.5 407.88,58.5 | v290.88,58.5 288.38,58.5 | 261.38,108 v264.38,108
G  (via drill 0.35)
  Top 0.2: v65.38,59.5 v48.38,59.5 v32.88,59.5 | v107.38,79 v88.38,79 75.88,79 75.38,78.5 65.88,78.5 v65.38,79 v46.38,79 29.88,79 v29.38,78.5 v22.88,78.5 v9.88,78.5 | v88.88,107.5 89.38,107 v109.38,107 117.38,107 117.88,107.5 v131.38,107.5 v153.88,107.5 167.88,107.5 v168.38,108 169.88,106.5 191.38,106.5 v191.88,107 v208.38,107 208.88,107.5 234.88,107.5 v235.38,108 235.88,108 236.88,107 v253.38,107 274.38,107 v274.88,106.5 v297.88,106.5 320.88,106.5 | 320.88,106.5 v321.88,107.5 | 320.88,106.5 v342.88,106.5 357.88,106.5 358.38,107 | 358.38,107 v359.38,108 | 358.38,107 v379.88,107 385.38,107 386.38,106 415.38,106 v418.38,103 | v226.38,21.5 v239.88,21.5 v252.38,21.5 v260.88,21.5 276.88,21.5 v277.88,22.5 299.88,22.5 | 299.88,22.5 317.88,22.5 v318.88,21.5 325.88,21.5 326.88,22.5 | 326.88,22.5 v329.38,25 | 326.88,22.5 337.38,22.5 v338.38,21.5 346.88,21.5 v347.88,22.5 356.38,22.5 v357.38,21.5 v367.38,21.5 v376.38,21.5 378.38,21.5 v385.38,28.5 | 299.88,22.5 v299.88,21.5 | 42.88,24.5 v43.88,25.5 | 36.38,24.5 33.38,24.5 v30.88,22 | 36.38,24.5 42.88,24.5 | v66.88,21.5 v52.88,21.5 39.38,21.5 36.38,24.5 | v69.38,34 68.88,33.5 68.38,33.5 67.38,32.5 59.88,32.5 51.88,24.5 42.88,24.5 | v163.88,60 165.38,60 v165.88,60.5 166.88,59.5 v176.88,59.5 v190.88,59.5 v199.88,59.5 206.88,59.5 v207.88,60.5 209.88,60.5 | 209.88,60.5 v209.88,64.5 | v209.38,42 213.38,42 v214.88,40.5 v252.38,40.5 v271.38,40.5 v290.38,40.5 | 209.88,60.5 217.38,60.5 v218.38,59.5 v228.88,59.5 v237.38,59.5 v248.38,59.5 v255.38,59.5 v267.38,59.5 v275.88,59.5 v286.38,59.5 v294.88,59.5 v305.38,59.5 v314.38,59.5 321.38,59.5 322.38,60.5
  Top 0.2: 322.38,60.5 v324.38,62.5 | 322.38,60.5 332.38,60.5 v333.38,59.5 342.38,59.5 v343.38,60.5 350.88,60.5 v351.88,59.5 361.38,59.5 v362.38,60.5 369.88,60.5 v370.88,59.5 380.38,59.5 v381.38,60.5 389.38,60.5 v390.38,59.5 402.38,59.5 | 402.38,59.5 v402.38,64 | 402.38,59.5 v413.88,59.5
  Bottom 0.2: 28.38,63.5 26.38,61.5 26.38,54 27.38,53 27.38,45.5 28.38,44.5 6NP.G- | 28.38,63.5 9NP.G- | 45.38,59.5 45.38,61 47.88,63.5 8NP.G- | 45.38,59.5 45.38,54 46.38,53 46.38,46 47.88,44.5 5NP.G- | v65.38,59.5 65.38,62 66.88,63.5 7NP.G- | 45.38,59.5 v48.38,59.5 | v32.88,59.5 28.88,63.5 9NP.G- | JP1.2 8.88,117.5 8.88,116.5 7.38,115 7.38,92 8.38,91 8.38,83.5 9.38,82.5 -NP.G- 9.88,82.5 v9.88,78.5 | END.G- 109.38,63.5 108.38,64.5 108.38,72 107.38,73 v107.38,79 107.38,80.5 109.38,82.5 HOME.G- | v29.38,78.5 29.38,82 28.88,82.5 *NP.G- | v46.38,79 47.88,80.5 47.88,82.5 /NP.G- | v65.38,79 65.38,81 66.88,82.5 NUMLK.G- | 28.38,63.5 22.88,69 v22.88,78.5 | 28.38,63.5 9NP.G- | 416.88,103 416.88,108.5 419.38,111 ESC.G- | 416.88,103 416.88,92 417.88,91 417.88,84 419.38,82.5 ~.G- | 89.38,81.5 90.38,82.5 PAGEUP.G- | 89.38,81.5 88.38,80.5 v88.38,79 88.38,73 89.38,72 89.38,64.5 90.38,63.5 PAGEDOWN.G- | 88.38,107.5 88.38,89.5 89.38,88.5 89.38,81.5 | 88.38,107.5 88.38,109 90.38,111 PAUSEBREAK.G- | v109.38,107 109.38,111 SCRLK.G- | 88.38,107.5 v88.88,107.5 | v131.38,107.5 131.38,108.5 128.88,111 PRTSC.G- | v153.88,107.5 153.88,110 152.88,111 F12.G- | v168.38,108 171.38,111 F11.G- | v191.88,107 191.88,110 190.88,111 F10.G- | v208.38,107 208.38,110 209.38,111 F9.G- | v235.38,108 238.38,111 F8.G- | v253.38,107 257.38,111 F7.G- | v274.88,106.5 274.88,109.5 276.38,111 F6.G- | v321.88,107.5 321.88,109 323.88,111 F4.G- | v342.88,106.5 342.88,111 F3.G- | v359.38,108 359.38,108.5 361.88,111 F2.G- | v379.88,107 379.88,110 380.88,111 F1.G- | v418.38,103 416.88,103 | 411.88,7.5 411.88,21.5 407.88,25.5 SHIFT1.G- | 411.88,7.5 412.88,6.5 416.88,6.5 CTRL1.G-
  Bottom 0.2: 392.88,5.5 370.38,5.5 369.38,6.5 ALT1.G- 368.88,6.5 367.88,7.5 367.88,12 366.88,13 366.88,17.5 367.38,18 v367.38,21.5 367.38,44.5 S.G- | 392.88,5.5 392.88,6.5 WIN.G- | 411.88,7.5 399.88,7.5 399.88,7 398.38,5.5 392.88,5.5 | SPACE.G- 297.88,6.5 296.88,6.5 296.88,13 299.88,16 v299.88,21.5 299.88,25.5 B.G- | 223.88,21.5 223.88,13.5 224.88,12.5 224.88,8 226.38,6.5 ALT2.G- | 223.88,21.5 223.88,25.5 ..G- | v239.88,21.5 239.88,22.5 242.88,25.5 ,.G- | 223.88,21.5 v226.38,21.5 | v252.38,21.5 v252.38,40.5 252.38,44.5 K.G- | v260.88,21.5 260.88,24.5 261.88,25.5 M.G- | v277.88,22.5 280.88,25.5 N.G- | v318.88,21.5 318.88,25.5 V.G- | v329.38,25 329.38,44.5 F.G- | v338.38,21.5 338.38,25.5 C.G- | v347.88,22.5 347.88,44.5 D.G- | v357.38,21.5 357.38,25.5 X.G- | v376.38,21.5 376.38,25.5 Z.G- | v385.38,28.5 385.38,44 385.88,44.5 A.G- | 27.88,25 28.38,25.5 3NP.G- | 27.88,25 26.38,23.5 26.38,16 27.38,15 27.38,7.5 28.38,6.5 ,NP.G- | v43.88,25.5 47.88,25.5 2NP.G- | 27.88,25 v30.88,22 | v66.88,21.5 66.88,25.5 1NP.G- | v69.38,34 69.38,42.5 67.38,44.5 4NP.G- | +NP.G- 9.38,54 9.38,49.5 7.38,47.5 7.38,25.5 8.38,24.5 8.38,17 9.38,16 ENTERNP.G- 9.88,16 13.38,12.5 13.38,4.5 16.88,1 52.88,1 | 108.38,7.5 109.38,6.5 DOWN.G- | 108.38,7.5 108.38,15 107.38,16 107.38,20.5 109.38,22.5 109.38,25.5 UP.G- | 90.38,4 90.38,6.5 RIGHT.G- | 90.38,4 90.38,1 63.38,1 57.88,6.5 0NP.G- 57.38,6.5 57.38,1 52.88,1 | 108.38,7.5 105.88,7.5 104.88,6.5 103.88,6.5 103.88,4.5 | 103.88,4.5 103.38,4 90.38,4 | 52.88,1 v52.88,21.5 | INS.G- 128.38,82.5 126.38,80.5 126.38,73 127.38,72 127.38,64.5 128.38,63.5 DEL.G- 128.88,63.5 129.88,62.5 129.88,21 126.38,17.5 126.38,13 127.38,12 127.38,7.5 128.38,6.5 LEFT.G- 128.88,6.5 131.88,3.5
  Bottom 0.2: 131.88,3.5 132.88,2.5 154.88,2.5 | 154.88,2.5 154.88,6.5 CTRL2.G- | 165.38,0.5 154.88,0.5 154.88,2.5 | 165.38,0.5 173.88,0.5 174.38,1 174.38,2.5 178.38,6.5 MENU.G- | =.G- 190.88,82.5 v190.88,59.5 190.88,49 195.38,44.5 '.G- 195.88,44.5 195.88,6.5 202.38,6.5 FN.G- | G.G- 309.38,44.5 305.38,48.5 v305.38,59.5 305.38,82.5 6.G- 304.88,82.5 299.88,87.5 299.88,107 298.88,108 | 298.88,108 295.88,111 F5.G- | L.G- 233.38,44.5 228.88,49 v228.88,59.5 228.88,82.5 0.G- | 414.38,59.5 414.38,63.5 TAB.G- | 414.38,59.5 414.38,54.5 410.88,51 410.88,45.5 411.88,44.5 CAPSLOCK.G- | 159.88,60 159.88,49 164.38,44.5 ENTER.G- 164.88,44.5 164.88,25.5 165.38,25.5 | 159.88,60 159.88,61.5 157.88,63.5 BACKSLASH.G- | v165.88,60.5 165.88,79 162.38,82.5 BACKSPACE.G- | 159.88,60 v163.88,60 | 165.38,25.5 168.88,25.5 SHIFT2.G- | v176.88,59.5 180.88,63.5 ].G- | v199.88,59.5 199.88,63.5 [.G- | 204.88,46.5 207.88,49.5 v207.88,60.5 | 204.88,46.5 202.38,44 202.38,35 203.38,34 203.38,27 204.88,25.5 /.G- | v209.88,64.5 209.88,82.5 -.G- | v214.88,40.5 214.88,44.5 SEMICOLON.G- | 204.88,46.5 v209.38,42 | v218.38,59.5 218.38,63 218.88,63.5 P.G- | v237.38,59.5 237.38,62.5 238.38,63.5 O.G- | v255.38,59.5 255.38,61.5 257.38,63.5 I.G- | v248.38,59.5 248.38,82.5 9.G- | v271.38,40.5 271.38,44.5 J.G- | v275.88,59.5 275.88,63 276.38,63.5 U.G- | v267.38,59.5 267.38,82.5 8.G- | v290.38,40.5 290.38,44.5 H.G- | v294.88,59.5 294.88,63 295.38,63.5 Y.G- | v286.38,59.5 286.38,82.5 7.G- | v314.38,59.5 314.38,63.5 T.G- | v324.38,62.5 324.38,82.5 5.G- | v333.38,59.5 333.38,63.5 R.G- | v343.38,60.5 343.38,82.5 4.G- | v351.88,59.5 351.88,63 352.38,63.5 E.G-
  Bottom 0.2: v362.38,60.5 362.38,82.5 3.G- | v370.88,59.5 370.88,63 371.38,63.5 W.G- | v381.38,60.5 381.38,82.5 2.G- | v390.38,59.5 390.38,63.5 Q.G- | v402.38,64 402.38,80.5 400.38,82.5 1.G- | v413.88,59.5 414.38,59.5 | 165.38,25.5 165.38,0.5 | 103.88,4.5 112.88,4.5 112.88,1.5 113.88,0.5 131.88,0.5 131.88,3.5 | v297.88,106.5 298.88,107.5 298.88,108
GND  (via drill 0.35)
  Top 0.2: v70.38,112 68.88,110.5 27.88,110.5 26.38,109 U$1.GND2
  Route2 0.2: v70.38,112 74.38,116 U$1.GND
  Bottom 0.2: U$1.GRND1 48.88,101.5 45.88,104.5 27.88,104.5 27.88,107.5 26.38,109 U$1.GND2
N$1  (via drill 0.35)
  Top 0.2: v277.88,120 283.88,126 362.88,126 365.88,129 390.38,129 393.38,126 411.38,126 415.38,122 ESC.MX2
  Route15 0.2: v193.38,123 191.88,123 191.38,123.5 179.88,123.5 178.38,122 173.88,122 172.38,123.5 145.88,123.5 124.38,102 115.38,102 114.38,101 D1.C
  Bottom 0.2: v277.88,120 278.38,120.5 278.38,122 275.38,125 227.88,125 227.88,100 226.88,99 221.88,99 221.88,116 213.38,124.5 193.38,124.5 v193.38,123
N$2  (via drill 0.35)
  Top 0.2: v110.38,95.5 119.88,95.5 120.38,96 133.38,96 136.88,92.5 157.88,92.5 BACKSPACE.MX2
  Route15 0.2: v110.38,95.5 108.88,95.5 97.88,106.5 86.38,106.5 68.88,124 53.88,124 52.88,125 D27.C
N$3  (via drill 0.35)
  Top 0.2: v383.88,123 383.38,123.5 378.88,123.5 377.38,122 F1.MX2
  Route2 0.2: v260.38,124 256.38,124 234.38,102 222.38,102 v209.38,89
  Route15 0.2: v383.88,123 371.88,135 275.88,135 264.88,124 v260.38,124 | v209.38,89 207.38,89 201.38,95 181.38,95 178.88,92.5 164.38,92.5 161.88,90 142.88,90 v137.38,95.5
  Bottom 0.2: v137.38,95.5 133.88,95.5 133.88,94.5 133.38,94 130.38,94 130.38,99.5 129.38,100.5 D2.C
N$4  (via drill 0.35)
  Top 0.2: v343.88,123.5 356.38,123.5 357.88,122 F2.MX2
  Route2 0.2: v343.88,123.5 328.38,123.5 327.88,124 300.38,124 295.88,119.5 288.88,119.5 273.88,134.5 v249.38,134.5
  Bottom 0.2: v249.38,134.5 222.88,134.5 222.88,135 222.38,135.5 140.88,135.5 140.88,104 143.88,101 D3.C
N$5  (via drill 0.35)
  Top 0.2: v327.38,123 337.88,123 338.88,122 F3.MX2 | v320.88,132 319.88,133 v265.38,133
  Route15 0.2: v222.38,128.5 220.88,128.5 211.38,119 202.38,119 192.38,109 167.38,109 159.38,101 D4.C
  Bottom 0.2: v327.38,123 320.88,129.5 v320.88,132 | v265.38,133 258.38,126 227.38,126 227.38,128 226.88,128.5 v222.38,128.5
N$6  (via drill 0.35)
  Top 0.2: v296.38,123.5 318.38,123.5 319.88,122 F4.MX2
  Route2 0.2: v296.38,123.5 285.88,123.5 273.88,135.5 235.88,135.5 v229.88,129.5
  Route15 0.2: v229.88,129.5 229.88,127 208.88,106 179.38,106 174.38,101 D5.C
N$7  (via drill 0.35)
  Top 0.2: v281.38,122 291.38,122 F5.MX2 | v271.38,132 259.88,132 258.88,131 234.88,131 234.38,131.5 v190.88,131.5
  Bottom 0.2: v271.38,132 v281.38,122 | v190.88,131.5 185.88,126.5 185.88,104 188.88,101 D6.C
N$8  (via drill 0.35)
  Top 0.2: v239.38,123.5 257.88,123.5 258.38,123 271.38,123 272.38,122 F6.MX2
  Route2 0.2: v239.38,123.5 236.88,123.5 235.88,122.5 235.88,121.5 219.38,105 208.38,105 204.38,101 D7.C
N$9  (via drill 0.35)
  Top 0.2: v243.38,122 253.38,122 F7.MX2
  Route2 0.2: v243.38,122 241.38,122 237.38,118 234.88,118 220.38,103.5 220.38,102 219.38,101 D8.C
N$10  (via drill 0.35)
  Top 0.2: v229.38,120 232.88,120 234.38,121.5 F8.MX2
  Bottom 0.2: v229.38,120 232.38,117 232.38,102.5 233.88,101 D9.C
N$11  (via drill 0.35)
  Top 0.2: v146.88,57 149.38,54.5 160.38,54.5 ENTER.MX2
  Route2 0.2: v146.88,57 146.88,85 148.38,86.5 148.38,90.5 136.38,102.5 130.38,102.5 129.38,103.5 D54.C
N$12  (via drill 0.35)
  Top 0.2: v266.88,124 265.88,125 239.38,125 237.88,123.5 207.38,123.5 205.88,122 F9.MX2
  Bottom 0.2: v266.88,124 266.38,123.5 266.38,103 264.38,101 D10.C
N$13  (via drill 0.35)
  Top 0.2: v177.88,123 185.38,123 186.38,122 F10.MX2 | v174.38,131.5 175.38,130.5 232.38,130.5 233.88,129 248.38,129 249.38,130 266.38,130 267.38,131 v281.38,131
  Route15 0.2: v287.88,109.5 279.38,101 D11.C
  Bottom 0.2: v177.88,123 174.38,126.5 v174.38,131.5 | v281.38,131 288.38,131 288.38,114.5 287.88,114 v287.88,109.5
N$14  (via drill 0.35)
  Top 0.2: v147.38,115 150.88,115 150.88,116 155.88,121 166.88,121 167.38,121.5 F11.MX2 | v249.38,91.5 252.88,95 v293.38,95
  Route15 0.2: v154.38,87 156.88,87 158.88,85 184.88,85 188.38,81.5 235.38,81.5 244.88,91 248.88,91 v249.38,91.5
  Bottom 0.2: v147.38,115 149.88,112.5 149.88,91.5 v154.38,87 | v293.38,95 293.88,95.5 293.88,100.5 D12.C
N$15  (via drill 0.35)
  Top 0.2: v143.88,123 147.38,123 148.38,122 F12.MX2
  Route2 0.2: v143.88,123 150.88,123 157.88,130 227.88,130 229.38,128.5 249.38,128.5 249.88,129 278.38,129 291.38,116 291.38,115.5 300.88,106 303.88,106 308.88,101 D13.C
N$16  (via drill 0.35)
  Top 0.2: v331.88,108.5 333.38,110 385.88,110 387.88,108 424.88,108 424.88,102 415.88,93 ~.MX2
  Route2 0.2: v331.88,108.5 324.38,101 D14.C
N$17
  Top 0.2: 1.MX2 395.88,93 385.88,103 385.88,105.5 368.38,105.5 361.88,99 340.88,99 339.38,100.5 D15.C
N$18  (via drill 0.35)
  Top 0.2: v353.88,96 373.88,96 376.88,93 2.MX2
  Bottom 0.2: v353.88,96 353.88,100.5 D16.C
N$19  (via drill 0.35)
  Top 0.2: v362.88,95 360.38,95 358.38,93 3.MX2
  Bottom 0.2: v362.88,95 368.88,101 D17.C
N$20
  Top 0.2: 4.MX2 339.38,93 342.38,96 352.38,96 353.38,97 380.38,97 383.88,100.5 D18.C
N$21  (via drill 0.35)
  Top 0.2: v315.38,95.5 317.38,95.5 319.88,93 5.MX2
  Route2 0.2: v315.38,95.5 316.88,95.5 323.88,102.5 324.88,102.5 330.88,108.5 330.88,109 331.88,110 389.88,110 398.88,101 D19.C
N$22  (via drill 0.35)
  Top 0.2: v349.88,97 305.38,97 301.38,93 6.MX2
  Route2 0.2: v349.88,97 410.38,97 413.88,100.5 D20.C
N$23  (via drill 0.35)
  Top 0.2: v143.38,91 162.88,91 165.38,93.5 171.88,93.5 173.88,91.5 183.88,91.5 184.38,91 191.38,91 193.88,93.5 200.38,93.5 202.88,91 210.38,91 211.88,92.5 220.38,92.5 221.88,91 229.38,91 231.88,93.5 238.38,93.5 241.38,90.5 249.88,90.5 251.88,92.5 258.38,92.5 259.88,91 267.38,91 269.88,93.5 281.38,93.5 281.88,93 7.MX2
  Route2 0.2: v143.38,91 140.38,91 128.88,102.5 118.88,102.5 99.38,122 99.38,127 D21.C
N$24  (via drill 0.35)
  Top 0.2: v253.38,94 261.88,94 262.88,93 8.MX2
  Route2 0.2: v143.88,118.5 136.38,126 117.38,126 116.38,127 D22.C
  Route15 0.2: v253.38,94 242.38,105 232.38,105 226.88,99.5 158.38,99.5 143.88,114 v143.88,118.5
N$25  (via drill 0.35)
  Top 0.2: v201.38,97 249.38,97 249.38,95.5 248.88,95 246.38,95 244.38,93 9.MX2 | v200.88,110 161.88,110 v160.88,111
  Route2 0.2: v160.88,111 158.38,111 155.38,114 149.88,114 136.88,127 133.38,127 D23.C
  Bottom 0.2: v201.38,97 200.88,97.5 v200.88,110
N$26  (via drill 0.35)
  Top 0.2: v211.38,94 223.88,94 224.88,93 0.MX2
  Route15 0.2: v211.38,94 209.38,96 182.88,96 181.88,97 171.38,97 170.38,96 155.88,96 153.88,98 129.38,98 116.38,85 110.88,85 108.38,87.5 108.38,88.5 102.38,94.5 95.88,94.5 84.88,105.5 82.88,105.5 73.38,115 46.38,115 45.38,116 45.38,117 38.38,124 27.88,124 26.88,125 D24.C
N$27  (via drill 0.35)
  Top 0.2: v230.88,95 207.88,95 205.88,93 -.MX2
  Route2 0.2: v230.88,95 244.88,109 286.88,109 288.38,107.5 298.38,107.5 300.88,105 302.88,105 308.38,99.5 310.38,99.5 324.88,114 330.88,114 336.38,119.5 346.88,119.5 351.38,124 404.88,124 406.88,122 406.88,110.5 405.88,109.5 D25.C
N$29  (via drill 0.35)
  Top 0.2: v161.88,74.5 158.88,71.5 155.88,71.5 153.88,73.5 BACKSLASH.MX2 | v178.38,93.5 179.38,94.5 184.88,94.5 186.38,96 v248.38,96
  Route2 0.2: v161.88,74.5 161.88,77 v178.38,93.5
  Bottom 0.2: v248.38,96 248.88,96.5 248.88,100.5 D41.C
N$30  (via drill 0.35)
  Top 0.2: v248.88,42.5 396.88,42.5 403.38,36 SHIFT1.MX2 | v189.88,76 182.88,76 181.88,77 169.38,77 164.88,81.5 154.38,81.5 152.38,83.5 v145.38,83.5
  Route2 0.2: v248.88,42.5 248.88,39 241.88,32 234.38,32 230.38,28 202.88,28 v194.38,36.5
  Bottom 0.2: v194.38,36.5 189.88,41 v189.88,76 | v145.38,83.5 145.38,100 145.88,100.5 145.88,102 144.38,103.5 D55.C
N$31  (via drill 0.35)
  Top 0.2: v425.88,76 412.88,76 410.88,74 TAB.MX2
  Route15 0.2: v192.88,7 192.88,9 182.88,19 138.88,19 137.88,18 131.88,18 127.38,22.5 98.38,22.5 96.88,24 D28.C
  Bottom 0.2: v425.88,76 425.88,9.5 417.38,1 229.38,1 229.38,1.5 228.88,2 213.38,2 213.38,1.5 212.38,0.5 192.88,0.5 v192.88,7
N$32  (via drill 0.35)
  Top 0.2: v377.38,77 383.38,77 386.38,74 Q.MX2 | v159.88,134.5 v217.88,134.5
  Route15 0.2: v372.88,130.5 369.88,133.5 302.88,133.5 276.88,107.5 265.38,107.5 257.38,99.5 255.88,99.5 246.88,108.5 246.88,120 233.38,133.5 218.88,133.5 v217.88,134.5
  Bottom 0.2: v377.38,77 372.88,81.5 v372.88,130.5 | v159.88,134.5 150.38,134.5 150.38,127.5 D29.C
N$33  (via drill 0.35)
  Top 0.2: v182.88,89.5 183.38,89.5 187.88,85 384.38,85 385.88,86.5 392.38,86.5 392.38,83.5 388.38,79.5 373.38,79.5 367.88,74 W.MX2
  Bottom 0.2: v182.88,89.5 179.38,93 179.38,102 178.38,103 178.38,115 176.38,117 176.38,117.5 174.38,119.5 167.38,119.5 167.38,127 D30.C
N$34  (via drill 0.35)
  Top 0.2: v281.88,77 345.38,77 348.38,74 E.MX2 | v151.38,40 150.88,40.5 122.38,40.5 120.88,42 115.88,42 D31.C
  Route2 0.2: v281.88,77 275.38,70.5 270.88,70.5 257.38,57 250.88,57 232.88,39 227.38,39 225.88,37.5 224.88,37.5 222.88,39.5 187.88,39.5 183.88,35.5 171.38,35.5 169.38,33.5 157.88,33.5 v151.38,40
N$35  (via drill 0.35)
  Top 0.2: v318.88,74.5 328.88,74.5 329.38,74 R.MX2 | v202.38,13 201.88,13.5 v194.38,13.5
  Route15 0.2: v318.88,74.5 312.88,68.5 312.88,62.5 291.88,41.5 282.38,41.5 257.38,16.5 229.38,16.5 226.38,19.5 208.88,19.5 v202.38,13 | v194.38,13.5 194.38,15 181.38,28 150.38,28 146.38,24 134.88,24 D32.C
N$36  (via drill 0.35)
  Top 0.2: v298.88,74.5 309.88,74.5 310.38,74 T.MX2 | v244.38,18.5 243.38,19.5 204.38,19.5 203.88,20 165.88,20 v164.38,21.5 | v156.88,24 155.38,22.5 126.38,22.5 124.38,24.5 99.38,24.5 96.88,27 D33.C
  Route15 0.2: v298.88,74.5 294.88,70.5 290.88,70.5 270.38,50 270.38,47.5 244.38,21.5 v244.38,18.5
  Bottom 0.2: v164.38,21.5 160.88,25 156.88,25 v156.88,24
N$37  (via drill 0.35)
  Top 0.2: v223.38,74.5 225.88,77 238.88,77 239.88,76 289.38,76 291.38,74 Y.MX2
  Route2 0.2: v223.38,74.5 217.88,69 217.88,68.5 214.88,65.5 212.88,65.5 208.38,70 208.38,74.5 197.88,85 v186.38,85
  Bottom 0.2: v186.38,85 184.88,86.5 184.88,126.5 184.38,127 D34.C
N$38  (via drill 0.35)
  Top 0.2: v259.38,75 271.38,75 272.38,74 U.MX2
  Route15 0.2: v259.38,75 256.88,77.5 177.88,77.5 176.38,76 156.38,76 135.88,55.5 126.38,55.5 115.88,45 D35.C
N$39  (via drill 0.35)
  Top 0.2: v243.38,74.5 252.88,74.5 253.38,74 I.MX2 | v209.88,46 199.38,46 198.38,47 135.88,47 135.38,46.5 117.38,46.5 115.88,48 D36.C
  Route2 0.2: v243.38,74.5 240.38,71.5 234.38,71.5 212.88,50 212.88,49 v209.88,46
N$40  (via drill 0.35)
  Top 0.2: v239.88,72.5 239.88,75 238.88,76 236.88,76 234.88,74 O.MX2
  Route15 0.2: v239.88,72.5 236.88,69.5 236.88,63.5 227.88,54.5 227.88,44 226.88,43 183.88,43 178.88,38 162.88,38 159.38,34.5 145.38,34.5 137.88,27 134.88,27 D37.C
N$41  (via drill 0.35)
  Top 0.2: v85.38,81.5 101.38,81.5 104.88,85 176.88,85 183.38,78.5 210.38,78.5 214.88,74 P.MX2 | v84.88,31.5 87.88,28.5 94.88,28.5 96.38,30 D38.C
  Bottom 0.2: v85.38,81.5 85.38,32 v84.88,31.5
N$42  (via drill 0.35)
  Top 0.2: v158.38,77 162.38,77 163.38,76 181.88,76 182.88,75 194.88,75 195.88,74 [.MX2 | v151.38,58.5 111.88,58.5 108.88,55.5 107.38,55.5 106.38,54.5 v101.38,54.5
  Bottom 0.2: v158.38,77 155.38,77 155.38,75 151.38,71 v151.38,58.5 | v101.38,54.5 98.38,51.5 98.38,38.5 97.38,37.5 94.88,37.5 94.88,34.5 96.38,33 D39.C
N$43  (via drill 0.35)
  Top 0.2: v172.38,74 176.88,74 ].MX2 | v171.88,64.5 168.88,61.5 v136.88,61.5
  Bottom 0.2: v172.38,74 171.88,73.5 v171.88,64.5 | v136.88,61.5 134.88,59.5 134.88,57 D40.C
N$44  (via drill 0.35)
  Top 0.2: v183.88,34.5 183.38,34.5 179.88,38 167.38,38 165.38,36 SHIFT2.MX2
  Route15 0.2: v183.88,34.5 191.88,26.5 191.88,21.5 202.38,11 202.38,10.5 203.88,9 304.88,9 305.38,8.5 311.38,8.5 336.38,33.5 339.88,33.5 349.88,43.5 352.38,43.5 366.38,57.5 370.38,57.5 395.88,83 395.88,102.5 405.38,112 D66.C
N$45  (via drill 0.35)
  Top 0.2: v309.38,21.5 308.38,20.5 297.88,20.5 294.38,17 SPACE.MX2
  Route15 0.2: v309.38,21.5 318.88,31 318.88,32 330.38,43.5 331.88,43.5 346.88,58.5 346.88,82.5 352.88,88.5 352.88,102.5 353.88,103.5 D70.C
N$46  (via drill 0.35)
  Top 0.2: v390.38,55.5 407.38,55.5 407.88,55 CAPSLOCK.MX2 | v228.38,1 227.88,0.5 132.38,0.5 v130.88,2 | v123.88,61 123.38,61.5 v103.38,61.5
  Route2 0.2: v390.38,55.5 389.38,55.5 384.88,51 377.38,51 359.88,33.5 351.88,33.5 319.38,1 v228.38,1
  Bottom 0.2: v130.88,2 123.88,9 v123.88,61 | v103.38,61.5 103.38,81.5 100.38,84.5 100.38,99.5 99.38,100.5 D42.C
N$47  (via drill 0.35)
  Top 0.2: v386.88,57.5 384.88,57.5 382.38,55 A.MX2 | v287.88,15.5 286.88,16.5 248.38,16.5 244.38,20.5 v207.38,20.5 | v198.88,25.5 196.38,28 159.38,28 157.38,30 134.88,30 D43.C
  Route15 0.2: v386.88,57.5 383.88,57.5 359.88,33.5 354.38,33.5 v336.38,15.5
  Bottom 0.2: v336.38,15.5 318.38,15.5 318.38,14.5 308.38,4.5 287.88,4.5 v287.88,15.5 | v207.38,20.5 198.88,20.5 v198.88,25.5
N$48  (via drill 0.35)
  Top 0.2: v369.88,55.5 368.38,57 365.38,57 363.38,55 S.MX2
  Route2 0.2: v369.88,55.5 368.88,55.5 367.38,57 345.38,57 321.88,33.5 317.38,33.5 297.38,13.5 275.38,13.5 268.88,7 230.88,7 227.88,4 152.88,4 137.88,19 v137.38,19
  Bottom 0.2: v137.38,19 136.38,20 136.38,31.5 134.88,33 D44.C
N$49  (via drill 0.35)
  Top 0.2: v338.38,45 343.88,50.5 343.88,54.5 D.MX2
  Route15 0.2: v332.88,27 306.88,1 229.88,1 227.38,3.5 159.88,3.5 157.38,1 114.38,1 v104.38,11
  Bottom 0.2: v338.38,45 332.88,39.5 v332.88,27 | v104.38,11 98.38,17 98.38,34.5 96.88,36 D45.C
N$50  (via drill 0.35)
  Top 0.2: v331.38,55 329.38,57 327.38,57 325.38,55 F.MX2 | v290.38,12.5 286.88,9 221.38,9 218.38,6 206.38,6 205.38,5 v143.38,5
  Route15 0.2: v331.38,55 331.38,54 327.38,50 327.38,47.5 298.88,19 296.88,19 v290.38,12.5 | v143.38,5 140.88,2.5 131.88,2.5 113.88,20.5 98.38,20.5 95.38,23.5 95.38,38 96.38,39 D46.C
N$51  (via drill 0.35)
  Top 0.2: v295.88,55.5 304.88,55.5 305.38,55 G.MX2 | v270.38,27 267.88,24.5 184.88,24.5 184.38,25 172.88,25 172.38,24.5 161.38,24.5 160.88,25 135.88,25 135.38,25.5 v122.88,25.5
  Route2 0.2: v295.88,55.5 296.88,54.5 297.38,54.5 299.38,52.5 299.38,48 289.38,38 279.88,38 270.38,28.5 v270.38,27
  Route15 0.2: v121.88,54 118.88,54 115.88,51 D47.C
  Bottom 0.2: v122.88,25.5 121.88,26.5 v121.88,54
N$52  (via drill 0.35)
  Top 0.2: v312.88,55.5 311.38,57 288.88,57 286.88,55 H.MX2 | v273.88,22.5 197.88,22.5 v196.88,21.5
  Route2 0.2: v312.88,55.5 312.88,54.5 308.38,50 308.38,48.5 283.38,23.5 274.88,23.5 v273.88,22.5 | v196.88,21.5 187.88,21.5 186.38,20 167.38,20 151.38,36 134.88,36 D48.C
N$53  (via drill 0.35)
  Top 0.2: v254.38,54 255.88,55.5 266.88,55.5 267.38,55 J.MX2 | v235.38,39.5 184.38,39.5 183.88,40 180.88,40 179.88,39 161.38,39 160.38,40 156.88,40 155.88,39 134.88,39 D49.C
  Route2 0.2: v254.38,54 251.38,51 246.88,51 v235.38,39.5
N$54  (via drill 0.35)
  Top 0.2: v236.88,55.5 247.88,55.5 248.38,55 K.MX2 | v237.38,53.5 236.38,52.5 234.88,52.5 233.38,51 229.38,51 221.88,43.5 180.38,43.5 179.88,44 167.88,44 167.38,43.5 156.38,43.5 155.88,44 135.88,44 135.38,43.5 98.38,43.5 96.88,42 D50.C
  Bottom 0.2: v236.88,55.5 237.38,55 v237.38,53.5
N$55  (via drill 0.35)
  Top 0.2: v180.88,57.5 226.88,57.5 229.38,55 L.MX2 | v146.38,53 135.88,53 135.38,52.5 121.88,52.5 120.38,54 115.88,54 D51.C
  Route15 0.2: v180.88,57.5 176.88,61.5 155.88,61.5 147.38,53 v146.38,53
N$56  (via drill 0.35)
  Top 0.2: v200.38,55.5 209.88,55.5 210.38,55 SEMICOLON.MX2 | v193.88,62 193.38,62.5 175.38,62.5 172.38,65.5 160.88,65.5 160.38,66 146.88,66 138.38,74.5 v133.88,74.5
  Route2 0.2: v193.88,62 v200.38,55.5 | v133.88,74.5 117.88,90.5 117.88,91 106.38,102.5 100.38,102.5 99.38,103.5 D52.C
N$57  (via drill 0.35)
  Top 0.2: v144.88,60.5 153.88,60.5 155.88,58.5 168.88,58.5 172.88,54.5 191.38,54.5 '.MX2
  Route2 0.2: v144.88,60.5 144.88,65.5 115.38,95 115.38,102.5 114.38,103.5 D53.C
N$58  (via drill 0.35)
  Top 0.2: v100.88,28.5 95.88,28.5 94.88,27.5 89.88,27.5 89.38,27 D33.A | v101.38,50.5 101.88,51 107.88,51 D47.A 108.38,51 109.88,52.5 116.38,52.5 117.88,51 126.88,51 D95.A | v193.38,97 v169.88,97 v161.88,97 | v391.38,85.5 387.38,81.5 208.38,81.5 v205.88,84
  Route2 0.2: v101.38,50.5 99.38,52.5 96.38,52.5 82.88,66 64.88,66 31.38,99.5 31.38,101 U$1.F5 | v205.88,84 193.38,96.5 v193.38,97
  Route15 0.2: v144.38,49.5 134.38,49.5 132.88,51 127.38,51 D95.A
  Bottom 0.2: v100.88,28.5 101.38,29 v101.38,50.5 | D80.A 397.88,118 395.38,115.5 395.38,104.5 391.88,101 D19.A 391.38,100.5 v391.38,85.5 | v169.88,97 169.88,97.5 166.88,100.5 D5.A | v193.38,97 194.88,98.5 194.88,102 196.38,103.5 D59.A | v144.38,49.5 147.88,53 147.88,71.5 156.38,80 156.38,103 158.88,105.5 161.88,105.5 v161.88,97
N$59
  Top 0.2: ENTERNP.MX2 5.38,26.5 0.88,31 0.88,135.5 389.38,135.5 397.38,127.5 D102.C
N$60  (via drill 0.35)
  Top 0.2: v140.38,21.5 126.38,21.5 125.38,22.5 106.38,22.5 105.38,21.5 71.38,21.5 70.38,20.5 57.38,20.5 53.88,17 0NP.MX2
  Route2 0.2: v148.88,71 148.88,85.5 162.88,99.5 178.38,99.5 181.38,102.5 181.88,102.5 190.38,111 190.38,117.5 199.88,127 200.88,127 D103.C
  Bottom 0.2: v140.38,21.5 148.88,30 v148.88,71
N$61
  Top 0.2: +NP.MX2 5.38,64 5.38,49.5 7.38,49.5 13.38,43.5 82.38,43.5 88.38,49.5 132.88,49.5 134.38,51 D95.C